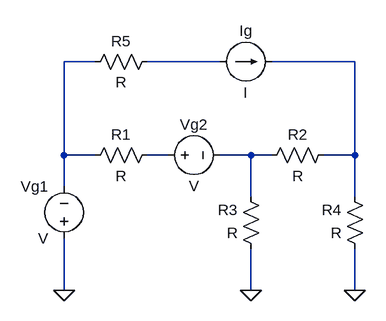
[diagram p0: schematic no_interviene_r5.asc]
no_interviene_r5.asc, the LTspice schematic file:
Version 4
SHEET 1 880 680
WIRE 48 -32 0 -32
WIRE 240 -32 128 -32
WIRE 448 -32 320 -32
WIRE 0 112 0 -32
WIRE 48 112 0 112
WIRE 160 112 128 112
WIRE 288 112 240 112
WIRE 320 112 288 112
WIRE 448 112 448 -32
WIRE 448 112 400 112
WIRE 0 160 0 112
WIRE 288 176 288 112
WIRE 448 176 448 112
WIRE 0 320 0 240
WIRE 288 320 288 256
WIRE 448 320 448 256
FLAG 0 320 0
FLAG 448 320 0
FLAG 288 320 0
SYMBOL voltage 0 256 R180
WINDOW 0 24 96 Left 2
WINDOW 3 24 16 Left 2
SYMATTR InstName Vg1
SYMBOL res 144 96 R90
WINDOW 0 0 56 VBottom 2
WINDOW 3 32 56 VTop 2
SYMATTR InstName R1
SYMBOL voltage 144 112 R270
WINDOW 0 32 56 VTop 2
WINDOW 3 -32 56 VBottom 2
SYMATTR InstName Vg2
SYMBOL res 416 96 R90
WINDOW 0 0 56 VBottom 2
WINDOW 3 32 56 VTop 2
SYMATTR InstName R2
SYMBOL res 304 272 R180
WINDOW 0 36 76 Left 2
WINDOW 3 36 40 Left 2
SYMATTR InstName R3
SYMBOL res 464 272 R180
WINDOW 0 36 76 Left 2
WINDOW 3 36 40 Left 2
SYMATTR InstName R4
SYMBOL res 32 -16 R270
WINDOW 0 32 56 VTop 2
WINDOW 3 0 56 VBottom 2
SYMATTR InstName R5
SYMBOL current 240 -32 R270
WINDOW 0 32 40 VTop 2
WINDOW 3 -32 40 VBottom 2
SYMATTR InstName Ig

The netlist it stands for:
* no_interviene_r5.asc
Vg1 0 N001 V
R1 N004 N001 R
Vg2 N004 N005 V
R2 N003 N005 R
R3 0 N005 R
R4 0 N003 R
R5 N001 N002 R
Ig N002 N003 I
.backanno
.end